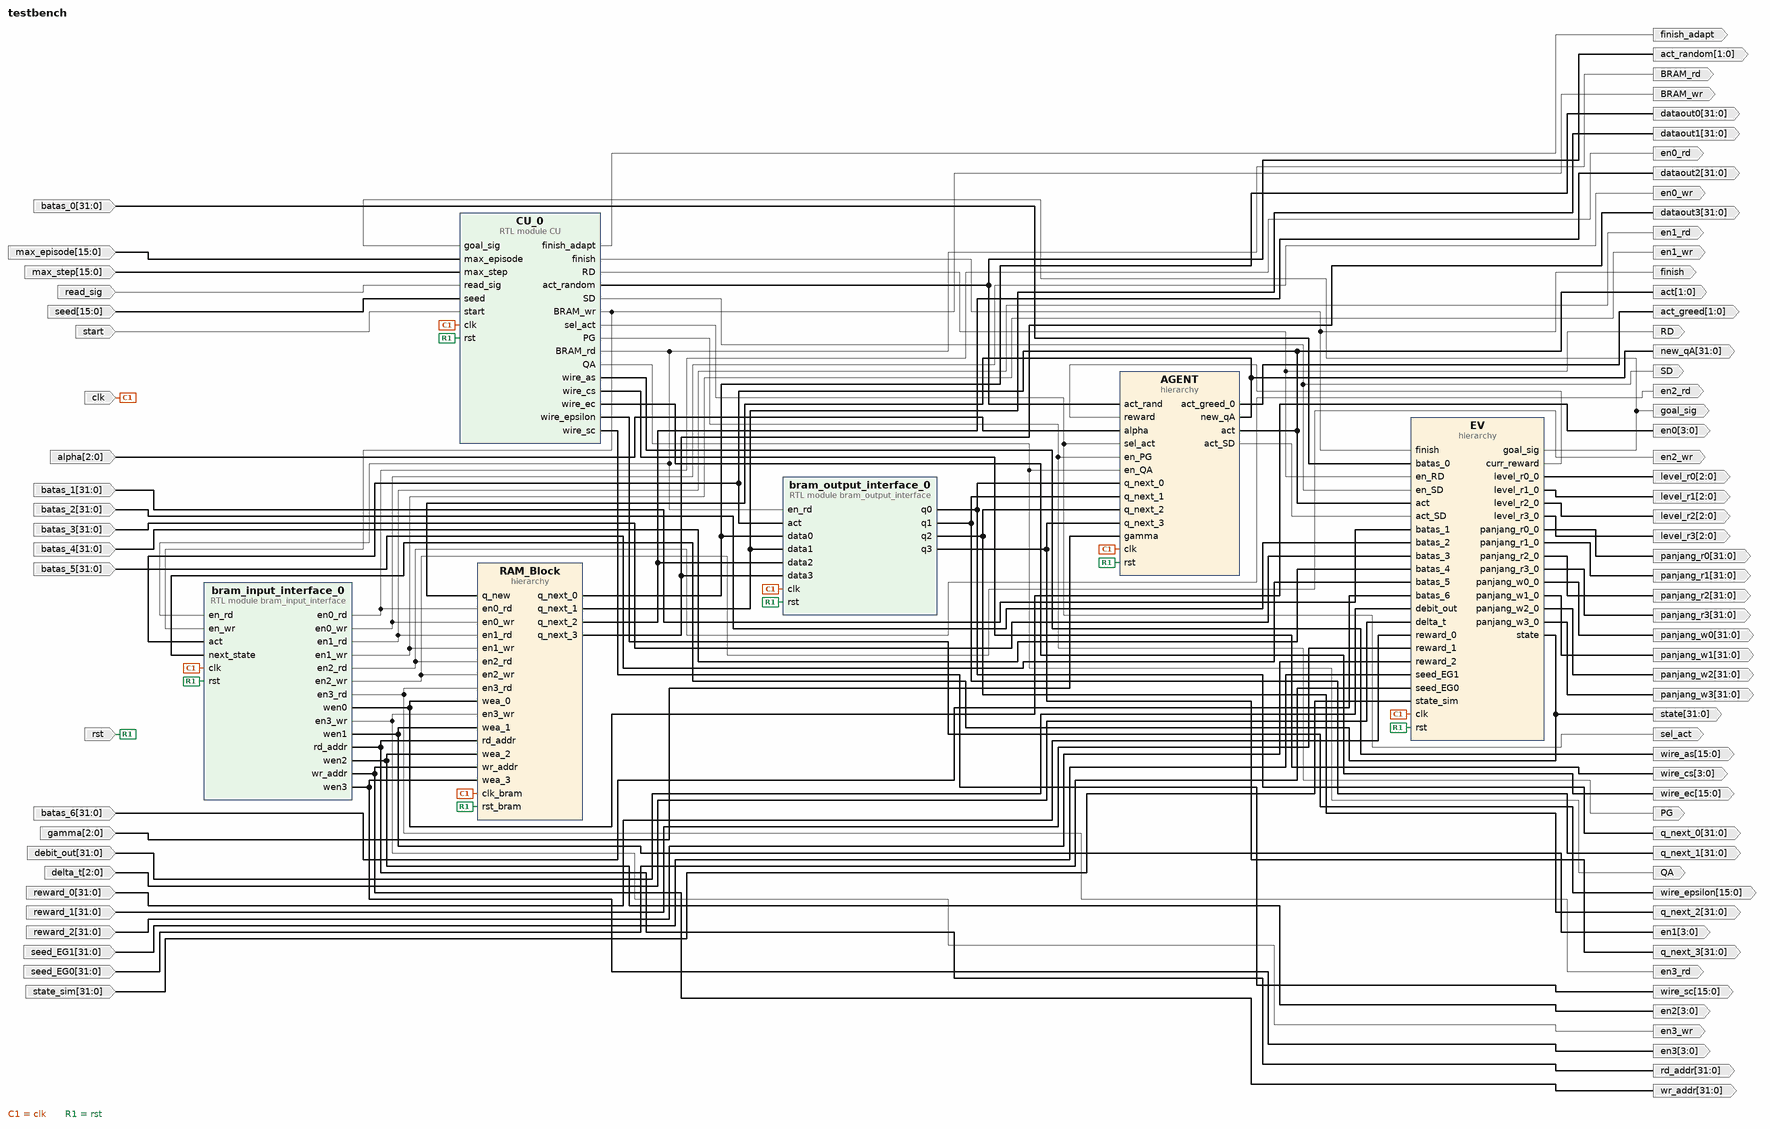
[diagram p0: block diagram of the top level]
# Vivado block design testbench, xc7z020clg400-1, Vivado 2021.1
create_bd_design testbench

create_bd_port -dir I -type clk clk
set_property -dict {CONFIG.FREQ_HZ 50000000} [get_bd_ports clk]
create_bd_port -dir I -type rst rst
create_bd_port -dir I -from 2 -to 0 alpha
create_bd_port -dir I -from 2 -to 0 gamma
create_bd_port -dir O finish
create_bd_port -dir I -from 15 -to 0 seed
create_bd_port -dir I -from 15 -to 0 max_episode
create_bd_port -dir I -from 15 -to 0 max_step
create_bd_port -dir I start
create_bd_port -dir I -from 31 -to 0 reward_0
create_bd_port -dir I -from 31 -to 0 reward_1
create_bd_port -dir I -from 31 -to 0 reward_2
create_bd_port -dir I -from 2 -to 0 delta_t
create_bd_port -dir I -from 31 -to 0 batas_0
create_bd_port -dir I -from 31 -to 0 batas_1
create_bd_port -dir I -from 31 -to 0 batas_2
create_bd_port -dir O PG
create_bd_port -dir O QA
create_bd_port -dir O SD
create_bd_port -dir O RD
create_bd_port -dir O -from 15 -to 0 wire_sc
create_bd_port -dir O -from 15 -to 0 wire_ec
create_bd_port -dir O -from 3 -to 0 wire_cs
create_bd_port -dir O goal_sig
create_bd_port -dir O -from 31 -to 0 state
create_bd_port -dir O sel_act
create_bd_port -dir O -from 2 -to 0 level_r0
create_bd_port -dir O -from 2 -to 0 level_r1
create_bd_port -dir O -from 2 -to 0 level_r2
create_bd_port -dir O -from 2 -to 0 level_r3
create_bd_port -dir O -from 31 -to 0 panjang_w0
create_bd_port -dir O -from 31 -to 0 panjang_w1
create_bd_port -dir O -from 31 -to 0 panjang_w2
create_bd_port -dir O -from 31 -to 0 panjang_w3
create_bd_port -dir O -from 31 -to 0 panjang_r0
create_bd_port -dir O -from 31 -to 0 panjang_r1
create_bd_port -dir O -from 31 -to 0 panjang_r2
create_bd_port -dir O -from 31 -to 0 panjang_r3
create_bd_port -dir O -from 1 -to 0 act
create_bd_port -dir O -from 1 -to 0 act_greed
create_bd_port -dir O -from 31 -to 0 q_next_3
create_bd_port -dir O -from 31 -to 0 q_next_0
create_bd_port -dir O -from 31 -to 0 q_next_1
create_bd_port -dir O -from 31 -to 0 q_next_2
create_bd_port -dir O -from 31 -to 0 new_qA
create_bd_port -dir O -from 31 -to 0 rd_addr
create_bd_port -dir O -from 31 -to 0 wr_addr
create_bd_port -dir O -from 3 -to 0 en0
create_bd_port -dir O -from 3 -to 0 en1
create_bd_port -dir O -from 3 -to 0 en2
create_bd_port -dir O -from 3 -to 0 en3
create_bd_port -dir O -from 1 -to 0 act_random
create_bd_port -dir O -from 31 -to 0 dataout3
create_bd_port -dir O -from 31 -to 0 dataout0
create_bd_port -dir O -from 31 -to 0 dataout1
create_bd_port -dir O -from 31 -to 0 dataout2
create_bd_port -dir O en0_wr
create_bd_port -dir O en0_rd
create_bd_port -dir O en1_wr
create_bd_port -dir O en1_rd
create_bd_port -dir O en2_wr
create_bd_port -dir O en2_rd
create_bd_port -dir O en3_wr
create_bd_port -dir O en3_rd
create_bd_port -dir I -from 31 -to 0 debit_out
create_bd_port -dir I -from 31 -to 0 state_sim
create_bd_port -dir O BRAM_rd
create_bd_port -dir O BRAM_wr
create_bd_port -dir O -from 15 -to 0 wire_as
create_bd_port -dir O -from 15 -to 0 wire_epsilon
create_bd_port -dir O finish_adapt
create_bd_port -dir I -from 31 -to 0 batas_3
create_bd_port -dir I -from 31 -to 0 batas_4
create_bd_port -dir I -from 31 -to 0 batas_5
create_bd_port -dir I -from 31 -to 0 batas_6
create_bd_port -dir I read_sig
create_bd_port -dir I -from 31 -to 0 seed_EG0
create_bd_port -dir I -from 31 -to 0 seed_EG1

create_bd_cell -type hier AGENT
create_bd_cell -type hier EV
create_bd_cell -type hier RAM_Block
create_bd_cell -type module -reference bram_output_interface bram_output_interface_0
create_bd_cell -type module -reference bram_input_interface bram_input_interface_0
create_bd_cell -type module -reference CU CU_0

# ---- hierarchy /AGENT ----
current_bd_instance /AGENT
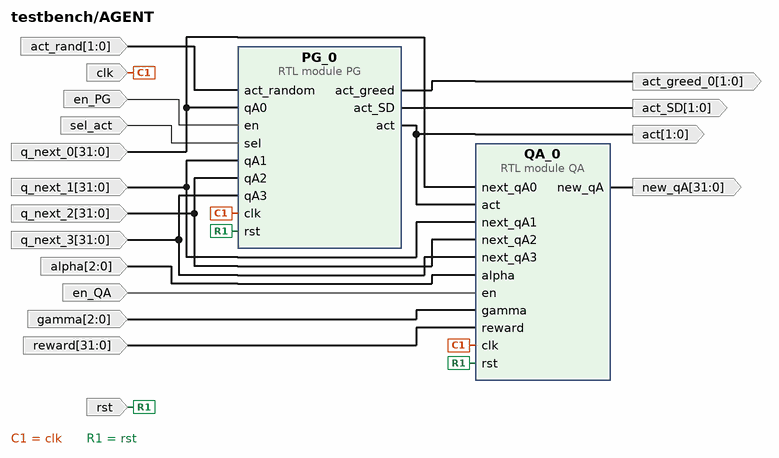
[diagram p1: block diagram inside /AGENT]
create_bd_pin -dir I sel_act
create_bd_pin -dir I -from 1 -to 0 act_rand
create_bd_pin -dir O -from 1 -to 0 act
create_bd_pin -dir I -type clk clk
create_bd_pin -dir I -type rst rst
create_bd_pin -dir I -from 31 -to 0 q_next_0
create_bd_pin -dir I -from 31 -to 0 q_next_1
create_bd_pin -dir I -from 31 -to 0 q_next_2
create_bd_pin -dir I -from 31 -to 0 q_next_3
create_bd_pin -dir O -from 31 -to 0 new_qA
create_bd_pin -dir I -from 2 -to 0 alpha
create_bd_pin -dir I -from 2 -to 0 gamma
create_bd_pin -dir I -from 31 -to 0 reward
create_bd_pin -dir I en_PG
create_bd_pin -dir I en_QA
create_bd_pin -dir O -from 1 -to 0 act_greed_0
create_bd_pin -dir O -from 1 -to 0 act_SD

create_bd_cell -type module -reference PG PG_0
create_bd_cell -type module -reference QA QA_0

# ---- hierarchy /EV ----
current_bd_instance /EV
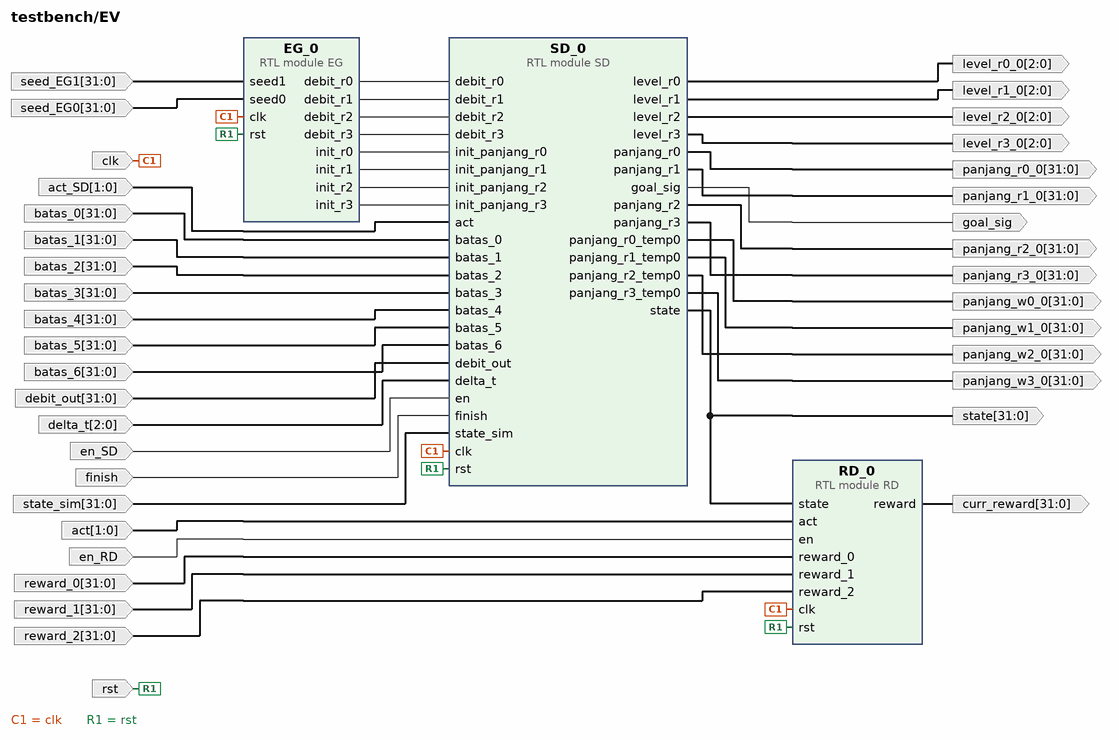
[diagram p2: block diagram inside /EV]
create_bd_pin -dir I -type clk clk
create_bd_pin -dir I -from 1 -to 0 act
create_bd_pin -dir I -from 2 -to 0 delta_t
create_bd_pin -dir I -from 31 -to 0 batas_0
create_bd_pin -dir I -from 31 -to 0 batas_1
create_bd_pin -dir I -from 31 -to 0 batas_2
create_bd_pin -dir O -from 31 -to 0 state
create_bd_pin -dir I -from 31 -to 0 reward_0
create_bd_pin -dir I -from 31 -to 0 reward_1
create_bd_pin -dir I -from 31 -to 0 reward_2
create_bd_pin -dir O -from 31 -to 0 curr_reward
create_bd_pin -dir O goal_sig
create_bd_pin -dir I -type rst rst
create_bd_pin -dir I en_SD
create_bd_pin -dir I en_RD
create_bd_pin -dir O -from 2 -to 0 level_r0_0
create_bd_pin -dir O -from 2 -to 0 level_r1_0
create_bd_pin -dir O -from 2 -to 0 level_r2_0
create_bd_pin -dir O -from 2 -to 0 level_r3_0
create_bd_pin -dir O -from 31 -to 0 panjang_w0_0
create_bd_pin -dir O -from 31 -to 0 panjang_w1_0
create_bd_pin -dir O -from 31 -to 0 panjang_w2_0
create_bd_pin -dir O -from 31 -to 0 panjang_w3_0
create_bd_pin -dir O -from 31 -to 0 panjang_r0_0
create_bd_pin -dir O -from 31 -to 0 panjang_r1_0
create_bd_pin -dir O -from 31 -to 0 panjang_r2_0
create_bd_pin -dir O -from 31 -to 0 panjang_r3_0
create_bd_pin -dir I -from 31 -to 0 debit_out
create_bd_pin -dir I finish
create_bd_pin -dir I -from 31 -to 0 state_sim
create_bd_pin -dir I -from 1 -to 0 act_SD
create_bd_pin -dir I -from 31 -to 0 batas_3
create_bd_pin -dir I -from 31 -to 0 batas_4
create_bd_pin -dir I -from 31 -to 0 batas_5
create_bd_pin -dir I -from 31 -to 0 batas_6
create_bd_pin -dir I -from 31 -to 0 seed_EG0
create_bd_pin -dir I -from 31 -to 0 seed_EG1

create_bd_cell -type module -reference RD RD_0
create_bd_cell -type module -reference SD SD_0
create_bd_cell -type module -reference EG EG_0

# ---- hierarchy /RAM_Block ----
current_bd_instance /RAM_Block
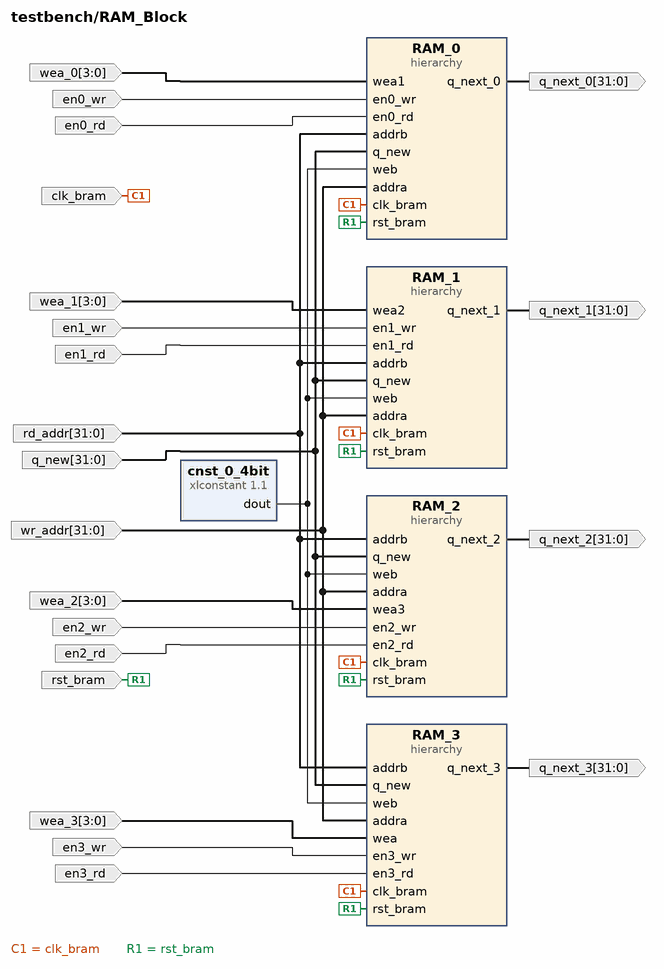
[diagram p3: block diagram inside /RAM_Block]
create_bd_pin -dir I -type clk clk_bram
create_bd_pin -dir I -type rst rst_bram
create_bd_pin -dir I -from 3 -to 0 wea_3
create_bd_pin -dir I -from 31 -to 0 wr_addr
create_bd_pin -dir I -from 31 -to 0 q_new
create_bd_pin -dir I -from 31 -to 0 rd_addr
create_bd_pin -dir O -from 31 -to 0 q_next_3
create_bd_pin -dir I -from 3 -to 0 wea_0
create_bd_pin -dir O -from 31 -to 0 q_next_0
create_bd_pin -dir I -from 3 -to 0 wea_1
create_bd_pin -dir O -from 31 -to 0 q_next_1
create_bd_pin -dir I -from 3 -to 0 wea_2
create_bd_pin -dir O -from 31 -to 0 q_next_2
create_bd_pin -dir I en0_wr
create_bd_pin -dir I en0_rd
create_bd_pin -dir I en1_wr
create_bd_pin -dir I en1_rd
create_bd_pin -dir I en2_wr
create_bd_pin -dir I en2_rd
create_bd_pin -dir I en3_wr
create_bd_pin -dir I en3_rd

create_bd_cell -type ip -vlnv xilinx.com:ip:xlconstant:1.1 cnst_0_4bit
set_property -dict {CONFIG.CONST_VAL 0 CONFIG.CONST_WIDTH 4} [get_bd_cells cnst_0_4bit]
create_bd_cell -type hier RAM_2
create_bd_cell -type hier RAM_1
create_bd_cell -type hier RAM_3
create_bd_cell -type hier RAM_0

# ---- hierarchy /RAM_Block/RAM_2 ----
current_bd_instance /RAM_Block/RAM_2
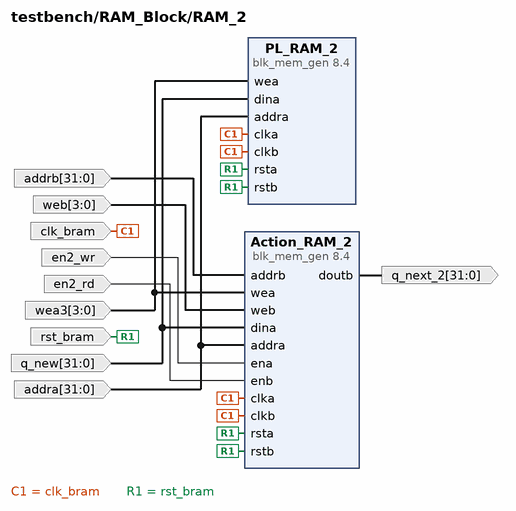
[diagram p4: block diagram inside /RAM_Block/RAM_2]
create_bd_pin -dir I -type clk clk_bram
create_bd_pin -dir I -type rst rst_bram
create_bd_pin -dir I -from 3 -to 0 wea3
create_bd_pin -dir I -from 31 -to 0 addra
create_bd_pin -dir I -from 31 -to 0 q_new
create_bd_pin -dir I -from 3 -to 0 web
create_bd_pin -dir I -from 31 -to 0 addrb
create_bd_pin -dir O -from 31 -to 0 q_next_2
create_bd_pin -dir I en2_wr
create_bd_pin -dir I en2_rd

create_bd_cell -type ip -vlnv xilinx.com:ip:blk_mem_gen:8.4 Action_RAM_2
set_property -dict [list \
  CONFIG.EN_SAFETY_CKT true \
  CONFIG.Enable_32bit_Address true \
  CONFIG.Enable_B Use_ENB_Pin \
  CONFIG.Memory_Type True_Dual_Port_RAM \
  CONFIG.Operating_Mode_A WRITE_FIRST \
  CONFIG.Operating_Mode_B WRITE_FIRST \
  CONFIG.Port_B_Clock 100 \
  CONFIG.Port_B_Enable_Rate 100 \
  CONFIG.Port_B_Write_Rate 50 \
  CONFIG.Read_Width_A 32 \
  CONFIG.Read_Width_B 32 \
  CONFIG.Register_PortA_Output_of_Memory_Primitives false \
  CONFIG.Register_PortB_Output_of_Memory_Primitives false \
  CONFIG.Use_RSTA_Pin true \
  CONFIG.Use_RSTB_Pin true \
  CONFIG.Write_Width_A 32 \
  CONFIG.Write_Width_B 32 \
  CONFIG.use_bram_block BRAM_Controller \
] [get_bd_cells Action_RAM_2]
create_bd_cell -type ip -vlnv xilinx.com:ip:blk_mem_gen:8.4 PL_RAM_2
set_property -dict [list \
  CONFIG.Enable_B Use_ENB_Pin \
  CONFIG.Memory_Type True_Dual_Port_RAM \
  CONFIG.Port_B_Clock 100 \
  CONFIG.Port_B_Enable_Rate 100 \
  CONFIG.Port_B_Write_Rate 50 \
  CONFIG.Use_RSTB_Pin true \
] [get_bd_cells PL_RAM_2]

# ---- hierarchy /RAM_Block/RAM_1 ----
current_bd_instance /RAM_Block/RAM_1
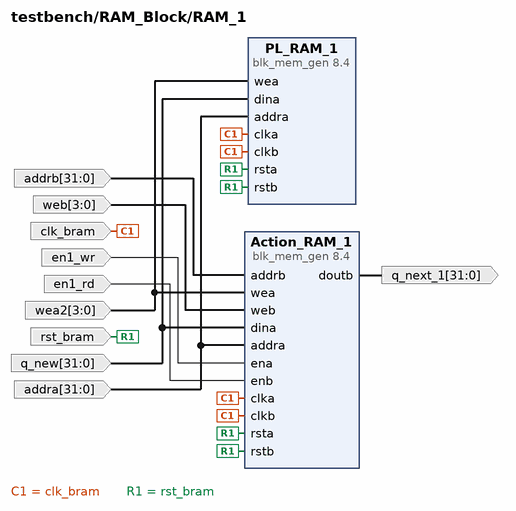
[diagram p5: block diagram inside /RAM_Block/RAM_1]
create_bd_pin -dir I -type clk clk_bram
create_bd_pin -dir I -type rst rst_bram
create_bd_pin -dir I -from 3 -to 0 wea2
create_bd_pin -dir I -from 31 -to 0 addra
create_bd_pin -dir I -from 31 -to 0 q_new
create_bd_pin -dir I -from 3 -to 0 web
create_bd_pin -dir I -from 31 -to 0 addrb
create_bd_pin -dir O -from 31 -to 0 q_next_1
create_bd_pin -dir I en1_wr
create_bd_pin -dir I en1_rd

create_bd_cell -type ip -vlnv xilinx.com:ip:blk_mem_gen:8.4 Action_RAM_1
set_property -dict [list \
  CONFIG.EN_SAFETY_CKT true \
  CONFIG.Enable_32bit_Address true \
  CONFIG.Enable_B Use_ENB_Pin \
  CONFIG.Memory_Type True_Dual_Port_RAM \
  CONFIG.Operating_Mode_A WRITE_FIRST \
  CONFIG.Operating_Mode_B WRITE_FIRST \
  CONFIG.Port_B_Clock 100 \
  CONFIG.Port_B_Enable_Rate 100 \
  CONFIG.Port_B_Write_Rate 50 \
  CONFIG.Read_Width_A 32 \
  CONFIG.Read_Width_B 32 \
  CONFIG.Register_PortA_Output_of_Memory_Primitives false \
  CONFIG.Register_PortB_Output_of_Memory_Primitives false \
  CONFIG.Use_RSTA_Pin true \
  CONFIG.Use_RSTB_Pin true \
  CONFIG.Write_Width_A 32 \
  CONFIG.Write_Width_B 32 \
  CONFIG.use_bram_block BRAM_Controller \
] [get_bd_cells Action_RAM_1]
create_bd_cell -type ip -vlnv xilinx.com:ip:blk_mem_gen:8.4 PL_RAM_1
set_property -dict [list \
  CONFIG.Enable_B Use_ENB_Pin \
  CONFIG.Memory_Type True_Dual_Port_RAM \
  CONFIG.Port_B_Clock 100 \
  CONFIG.Port_B_Enable_Rate 100 \
  CONFIG.Port_B_Write_Rate 50 \
  CONFIG.Use_RSTB_Pin true \
] [get_bd_cells PL_RAM_1]

# ---- hierarchy /RAM_Block/RAM_3 ----
current_bd_instance /RAM_Block/RAM_3
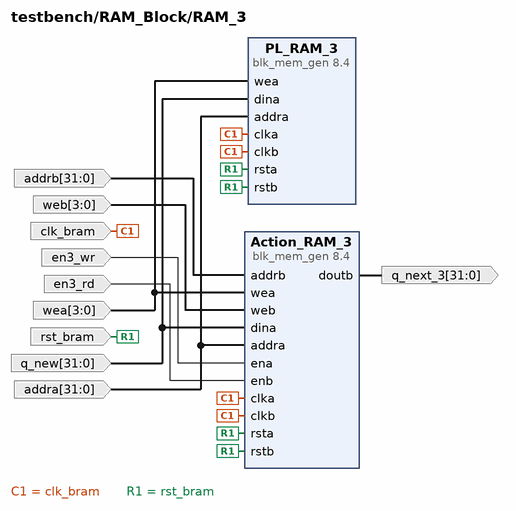
[diagram p6: block diagram inside /RAM_Block/RAM_3]
create_bd_pin -dir I -type clk clk_bram
create_bd_pin -dir I -type rst rst_bram
create_bd_pin -dir I -from 3 -to 0 wea
create_bd_pin -dir I -from 31 -to 0 addra
create_bd_pin -dir I -from 31 -to 0 q_new
create_bd_pin -dir I -from 3 -to 0 web
create_bd_pin -dir I -from 31 -to 0 addrb
create_bd_pin -dir O -from 31 -to 0 q_next_3
create_bd_pin -dir I en3_wr
create_bd_pin -dir I en3_rd

create_bd_cell -type ip -vlnv xilinx.com:ip:blk_mem_gen:8.4 Action_RAM_3
set_property -dict [list \
  CONFIG.EN_SAFETY_CKT true \
  CONFIG.Enable_32bit_Address true \
  CONFIG.Enable_B Use_ENB_Pin \
  CONFIG.Memory_Type True_Dual_Port_RAM \
  CONFIG.Operating_Mode_A WRITE_FIRST \
  CONFIG.Operating_Mode_B WRITE_FIRST \
  CONFIG.Port_B_Clock 100 \
  CONFIG.Port_B_Enable_Rate 100 \
  CONFIG.Port_B_Write_Rate 50 \
  CONFIG.Read_Width_A 32 \
  CONFIG.Read_Width_B 32 \
  CONFIG.Register_PortA_Output_of_Memory_Primitives false \
  CONFIG.Register_PortB_Output_of_Memory_Primitives false \
  CONFIG.Use_RSTA_Pin true \
  CONFIG.Use_RSTB_Pin true \
  CONFIG.Write_Width_A 32 \
  CONFIG.Write_Width_B 32 \
  CONFIG.use_bram_block BRAM_Controller \
] [get_bd_cells Action_RAM_3]
create_bd_cell -type ip -vlnv xilinx.com:ip:blk_mem_gen:8.4 PL_RAM_3
set_property -dict [list \
  CONFIG.Enable_B Use_ENB_Pin \
  CONFIG.Memory_Type True_Dual_Port_RAM \
  CONFIG.Port_B_Clock 100 \
  CONFIG.Port_B_Enable_Rate 100 \
  CONFIG.Port_B_Write_Rate 50 \
  CONFIG.Use_RSTB_Pin true \
] [get_bd_cells PL_RAM_3]

# ---- hierarchy /RAM_Block/RAM_0 ----
current_bd_instance /RAM_Block/RAM_0
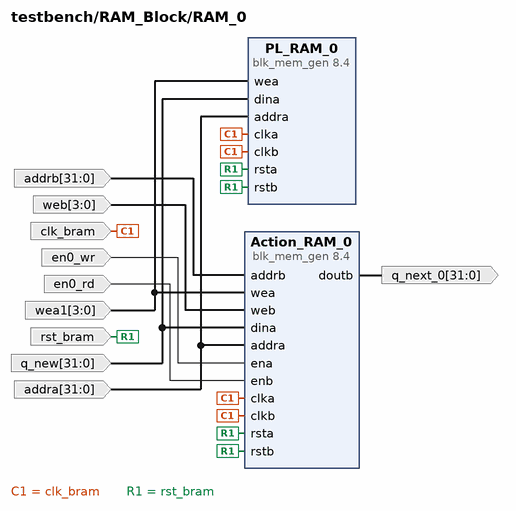
[diagram p7: block diagram inside /RAM_Block/RAM_0]
create_bd_pin -dir I -type clk clk_bram
create_bd_pin -dir I -type rst rst_bram
create_bd_pin -dir I -from 3 -to 0 wea1
create_bd_pin -dir I -from 31 -to 0 addra
create_bd_pin -dir I -from 31 -to 0 q_new
create_bd_pin -dir I -from 3 -to 0 web
create_bd_pin -dir I -from 31 -to 0 addrb
create_bd_pin -dir O -from 31 -to 0 q_next_0
create_bd_pin -dir I en0_wr
create_bd_pin -dir I en0_rd

create_bd_cell -type ip -vlnv xilinx.com:ip:blk_mem_gen:8.4 PL_RAM_0
set_property -dict [list \
  CONFIG.Enable_B Use_ENB_Pin \
  CONFIG.Memory_Type True_Dual_Port_RAM \
  CONFIG.Port_B_Clock 100 \
  CONFIG.Port_B_Enable_Rate 100 \
  CONFIG.Port_B_Write_Rate 50 \
  CONFIG.Use_RSTB_Pin true \
] [get_bd_cells PL_RAM_0]
create_bd_cell -type ip -vlnv xilinx.com:ip:blk_mem_gen:8.4 Action_RAM_0
set_property -dict [list \
  CONFIG.EN_SAFETY_CKT true \
  CONFIG.Enable_32bit_Address true \
  CONFIG.Enable_B Use_ENB_Pin \
  CONFIG.Memory_Type True_Dual_Port_RAM \
  CONFIG.Operating_Mode_A WRITE_FIRST \
  CONFIG.Operating_Mode_B WRITE_FIRST \
  CONFIG.Port_B_Clock 100 \
  CONFIG.Port_B_Enable_Rate 100 \
  CONFIG.Port_B_Write_Rate 50 \
  CONFIG.Read_Width_A 32 \
  CONFIG.Read_Width_B 32 \
  CONFIG.Register_PortA_Output_of_Memory_Primitives false \
  CONFIG.Register_PortB_Output_of_Memory_Primitives false \
  CONFIG.Use_RSTA_Pin true \
  CONFIG.Use_RSTB_Pin true \
  CONFIG.Write_Width_A 32 \
  CONFIG.Write_Width_B 32 \
  CONFIG.use_bram_block BRAM_Controller \
] [get_bd_cells Action_RAM_0]

# ---- connections ----

current_bd_instance /AGENT
connect_bd_net -net Action_RAM_q_next_0 [get_bd_pins q_next_0] [get_bd_pins PG_0/qA0] [get_bd_pins QA_0/next_qA0]
connect_bd_net -net Action_RAM_q_next_1 [get_bd_pins q_next_1] [get_bd_pins PG_0/qA1] [get_bd_pins QA_0/next_qA1]
connect_bd_net -net Action_RAM_q_next_2 [get_bd_pins q_next_2] [get_bd_pins PG_0/qA2] [get_bd_pins QA_0/next_qA2]
connect_bd_net -net Action_RAM_q_next_3 [get_bd_pins q_next_3] [get_bd_pins PG_0/qA3] [get_bd_pins QA_0/next_qA3]
connect_bd_net [get_bd_pins PG_0/act] [get_bd_pins act] [get_bd_pins QA_0/act]
connect_bd_net [get_bd_pins PG_0/act_SD] [get_bd_pins act_SD]
connect_bd_net [get_bd_pins PG_0/act_greed] [get_bd_pins act_greed_0]
connect_bd_net [get_bd_pins QA_0/new_qA] [get_bd_pins new_qA]
connect_bd_net -net act_random_0_1 [get_bd_pins act_rand] [get_bd_pins PG_0/act_random]
connect_bd_net [get_bd_pins alpha] [get_bd_pins QA_0/alpha]
connect_bd_net [get_bd_pins clk] [get_bd_pins PG_0/clk] [get_bd_pins QA_0/clk]
connect_bd_net -net en_1 [get_bd_pins en_PG] [get_bd_pins PG_0/en]
connect_bd_net -net en_2 [get_bd_pins en_QA] [get_bd_pins QA_0/en]
connect_bd_net [get_bd_pins gamma] [get_bd_pins QA_0/gamma]
connect_bd_net -net reg_32bit_0_out0 [get_bd_pins reward] [get_bd_pins QA_0/reward]
connect_bd_net -net rst_bram_1 [get_bd_pins rst] [get_bd_pins PG_0/rst] [get_bd_pins QA_0/rst]
connect_bd_net -net sel_0_1 [get_bd_pins sel_act] [get_bd_pins PG_0/sel]

current_bd_instance /EV
connect_bd_net [get_bd_pins EG_0/debit_r0] [get_bd_pins SD_0/debit_r0]
connect_bd_net [get_bd_pins EG_0/debit_r1] [get_bd_pins SD_0/debit_r1]
connect_bd_net [get_bd_pins EG_0/debit_r2] [get_bd_pins SD_0/debit_r2]
connect_bd_net [get_bd_pins EG_0/debit_r3] [get_bd_pins SD_0/debit_r3]
connect_bd_net [get_bd_pins EG_0/init_r0] [get_bd_pins SD_0/init_panjang_r0]
connect_bd_net [get_bd_pins EG_0/init_r1] [get_bd_pins SD_0/init_panjang_r1]
connect_bd_net [get_bd_pins EG_0/init_r2] [get_bd_pins SD_0/init_panjang_r2]
connect_bd_net [get_bd_pins EG_0/init_r3] [get_bd_pins SD_0/init_panjang_r3]
connect_bd_net -net PG_0_act [get_bd_pins act] [get_bd_pins RD_0/act]
connect_bd_net [get_bd_pins RD_0/reward] [get_bd_pins curr_reward]
connect_bd_net [get_bd_pins SD_0/level_r0] [get_bd_pins level_r0_0]
connect_bd_net [get_bd_pins SD_0/level_r1] [get_bd_pins level_r1_0]
connect_bd_net [get_bd_pins SD_0/level_r2] [get_bd_pins level_r2_0]
connect_bd_net [get_bd_pins SD_0/level_r3] [get_bd_pins level_r3_0]
connect_bd_net [get_bd_pins SD_0/panjang_r0] [get_bd_pins panjang_r0_0]
connect_bd_net [get_bd_pins SD_0/panjang_r1] [get_bd_pins panjang_r1_0]
connect_bd_net [get_bd_pins SD_0/panjang_r2] [get_bd_pins panjang_r2_0]
connect_bd_net [get_bd_pins SD_0/panjang_r3] [get_bd_pins panjang_r3_0]
connect_bd_net -net SD_0_panjang_w0 [get_bd_pins SD_0/panjang_r0_temp0] [get_bd_pins panjang_w0_0]
connect_bd_net -net SD_0_panjang_w1 [get_bd_pins SD_0/panjang_r1_temp0] [get_bd_pins panjang_w1_0]
connect_bd_net -net SD_0_panjang_w2 [get_bd_pins SD_0/panjang_r2_temp0] [get_bd_pins panjang_w2_0]
connect_bd_net -net SD_0_panjang_w3 [get_bd_pins SD_0/panjang_r3_temp0] [get_bd_pins panjang_w3_0]
connect_bd_net -net SD_0_sig_goal [get_bd_pins SD_0/goal_sig] [get_bd_pins goal_sig]
connect_bd_net -net act_0_1 [get_bd_pins act_SD] [get_bd_pins SD_0/act]
connect_bd_net -net batas_0_0_1 [get_bd_pins batas_0] [get_bd_pins SD_0/batas_0]
connect_bd_net -net batas_1_0_1 [get_bd_pins batas_1] [get_bd_pins SD_0/batas_1]
connect_bd_net -net batas_2_0_1 [get_bd_pins batas_2] [get_bd_pins SD_0/batas_2]
connect_bd_net -net batas_3_0_1 [get_bd_pins batas_3] [get_bd_pins SD_0/batas_3]
connect_bd_net -net batas_4_0_1 [get_bd_pins batas_4] [get_bd_pins SD_0/batas_4]
connect_bd_net -net batas_5_0_1 [get_bd_pins batas_5] [get_bd_pins SD_0/batas_5]
connect_bd_net -net batas_6_0_1 [get_bd_pins batas_6] [get_bd_pins SD_0/batas_6]
connect_bd_net [get_bd_pins clk] [get_bd_pins RD_0/clk] [get_bd_pins SD_0/clk] [get_bd_pins EG_0/clk]
connect_bd_net -net debit_out_0_1 [get_bd_pins debit_out] [get_bd_pins SD_0/debit_out]
connect_bd_net -net delta_t_0_1 [get_bd_pins delta_t] [get_bd_pins SD_0/delta_t]
connect_bd_net -net en_1 [get_bd_pins en_SD] [get_bd_pins SD_0/en]
connect_bd_net -net en_2 [get_bd_pins en_RD] [get_bd_pins RD_0/en]
connect_bd_net -net finish_0_1 [get_bd_pins finish] [get_bd_pins SD_0/finish]
connect_bd_net -net next_state_1 [get_bd_pins SD_0/state] [get_bd_pins state] [get_bd_pins RD_0/state]
connect_bd_net -net reward_0_0_1 [get_bd_pins reward_0] [get_bd_pins RD_0/reward_0]
connect_bd_net -net reward_1_0_1 [get_bd_pins reward_1] [get_bd_pins RD_0/reward_1]
connect_bd_net -net reward_2_0_1 [get_bd_pins reward_2] [get_bd_pins RD_0/reward_2]
connect_bd_net [get_bd_pins rst] [get_bd_pins RD_0/rst] [get_bd_pins SD_0/rst] [get_bd_pins EG_0/rst]
connect_bd_net -net seed1_0_1 [get_bd_pins seed_EG1] [get_bd_pins EG_0/seed1]
connect_bd_net -net seed_0_1 [get_bd_pins seed_EG0] [get_bd_pins EG_0/seed0]
connect_bd_net -net state_sim_0_1 [get_bd_pins state_sim] [get_bd_pins SD_0/state_sim]

current_bd_instance /RAM_Block
connect_bd_net -net Action_RAM_0_doutb [get_bd_pins RAM_0/q_next_0] [get_bd_pins q_next_0]
connect_bd_net -net Action_RAM_1_doutb [get_bd_pins RAM_1/q_next_1] [get_bd_pins q_next_1]
connect_bd_net -net Action_RAM_2_doutb [get_bd_pins RAM_2/q_next_2] [get_bd_pins q_next_2]
connect_bd_net -net Action_RAM_3_doutb [get_bd_pins RAM_3/q_next_3] [get_bd_pins q_next_3]
connect_bd_net -net bram_interface_0_en0 [get_bd_pins wea_0] [get_bd_pins RAM_0/wea1]
connect_bd_net -net bram_interface_0_en1 [get_bd_pins wea_1] [get_bd_pins RAM_1/wea2]
connect_bd_net -net bram_interface_0_en2 [get_bd_pins wea_2] [get_bd_pins RAM_2/wea3]
connect_bd_net -net bram_interface_0_en3 [get_bd_pins wea_3] [get_bd_pins RAM_3/wea]
connect_bd_net -net bram_interface_0_rd_addr [get_bd_pins rd_addr] \
  [get_bd_pins RAM_2/addrb] [get_bd_pins RAM_1/addrb] [get_bd_pins RAM_3/addrb] [get_bd_pins RAM_0/addrb]
connect_bd_net -net clk_0_1 [get_bd_pins clk_bram] \
  [get_bd_pins RAM_2/clk_bram] [get_bd_pins RAM_1/clk_bram] [get_bd_pins RAM_3/clk_bram] [get_bd_pins RAM_0/clk_bram]
connect_bd_net [get_bd_pins cnst_0_4bit/dout] [get_bd_pins RAM_2/web] [get_bd_pins RAM_1/web] [get_bd_pins RAM_3/web] [get_bd_pins RAM_0/web]
connect_bd_net -net dina_0_1 [get_bd_pins q_new] \
  [get_bd_pins RAM_2/q_new] [get_bd_pins RAM_1/q_new] [get_bd_pins RAM_3/q_new] [get_bd_pins RAM_0/q_new]
connect_bd_net -net ena_0_1 [get_bd_pins en0_wr] [get_bd_pins RAM_0/en0_wr]
connect_bd_net -net ena_1_1 [get_bd_pins en1_wr] [get_bd_pins RAM_1/en1_wr]
connect_bd_net -net ena_2_1 [get_bd_pins en2_wr] [get_bd_pins RAM_2/en2_wr]
connect_bd_net -net ena_3_1 [get_bd_pins en3_wr] [get_bd_pins RAM_3/en3_wr]
connect_bd_net -net enb_0_1 [get_bd_pins en0_rd] [get_bd_pins RAM_0/en0_rd]
connect_bd_net -net enb_1_1 [get_bd_pins en1_rd] [get_bd_pins RAM_1/en1_rd]
connect_bd_net -net enb_2_1 [get_bd_pins en2_rd] [get_bd_pins RAM_2/en2_rd]
connect_bd_net -net enb_3_1 [get_bd_pins en3_rd] [get_bd_pins RAM_3/en3_rd]
connect_bd_net -net reg_32bit_0_out0 [get_bd_pins wr_addr] \
  [get_bd_pins RAM_2/addra] [get_bd_pins RAM_1/addra] [get_bd_pins RAM_3/addra] [get_bd_pins RAM_0/addra]
connect_bd_net -net rsta_0_1 [get_bd_pins rst_bram] \
  [get_bd_pins RAM_2/rst_bram] [get_bd_pins RAM_1/rst_bram] [get_bd_pins RAM_3/rst_bram] [get_bd_pins RAM_0/rst_bram]

current_bd_instance /RAM_Block/RAM_2
connect_bd_net [get_bd_pins Action_RAM_2/doutb] [get_bd_pins q_next_2]
connect_bd_net -net bram_interface_0_en2 [get_bd_pins wea3] [get_bd_pins PL_RAM_2/wea] [get_bd_pins Action_RAM_2/wea]
connect_bd_net -net bram_interface_0_rd_addr [get_bd_pins addrb] [get_bd_pins Action_RAM_2/addrb]
connect_bd_net -net clk_0_1 [get_bd_pins clk_bram] \
  [get_bd_pins Action_RAM_2/clkb] [get_bd_pins PL_RAM_2/clka] [get_bd_pins Action_RAM_2/clka] [get_bd_pins PL_RAM_2/clkb]
connect_bd_net -net cnst_0_4bit_dout [get_bd_pins web] [get_bd_pins Action_RAM_2/web]
connect_bd_net -net dina_0_1 [get_bd_pins q_new] [get_bd_pins PL_RAM_2/dina] [get_bd_pins Action_RAM_2/dina]
connect_bd_net -net ena_2_1 [get_bd_pins en2_wr] [get_bd_pins Action_RAM_2/ena]
connect_bd_net -net enb_2_1 [get_bd_pins en2_rd] [get_bd_pins Action_RAM_2/enb]
connect_bd_net -net reg_32bit_0_out0 [get_bd_pins addra] [get_bd_pins PL_RAM_2/addra] [get_bd_pins Action_RAM_2/addra]
connect_bd_net -net rsta_0_1 [get_bd_pins rst_bram] \
  [get_bd_pins Action_RAM_2/rstb] [get_bd_pins PL_RAM_2/rsta] [get_bd_pins Action_RAM_2/rsta] [get_bd_pins PL_RAM_2/rstb]

current_bd_instance /RAM_Block/RAM_1
connect_bd_net [get_bd_pins Action_RAM_1/doutb] [get_bd_pins q_next_1]
connect_bd_net -net bram_interface_0_en1 [get_bd_pins wea2] [get_bd_pins PL_RAM_1/wea] [get_bd_pins Action_RAM_1/wea]
connect_bd_net -net bram_interface_0_rd_addr [get_bd_pins addrb] [get_bd_pins Action_RAM_1/addrb]
connect_bd_net -net clk_0_1 [get_bd_pins clk_bram] \
  [get_bd_pins Action_RAM_1/clkb] [get_bd_pins PL_RAM_1/clka] [get_bd_pins Action_RAM_1/clka] [get_bd_pins PL_RAM_1/clkb]
connect_bd_net -net cnst_0_4bit_dout [get_bd_pins web] [get_bd_pins Action_RAM_1/web]
connect_bd_net -net dina_0_1 [get_bd_pins q_new] [get_bd_pins PL_RAM_1/dina] [get_bd_pins Action_RAM_1/dina]
connect_bd_net -net ena_1_1 [get_bd_pins en1_wr] [get_bd_pins Action_RAM_1/ena]
connect_bd_net -net enb_1_1 [get_bd_pins en1_rd] [get_bd_pins Action_RAM_1/enb]
connect_bd_net -net reg_32bit_0_out0 [get_bd_pins addra] [get_bd_pins PL_RAM_1/addra] [get_bd_pins Action_RAM_1/addra]
connect_bd_net -net rsta_0_1 [get_bd_pins rst_bram] \
  [get_bd_pins Action_RAM_1/rstb] [get_bd_pins PL_RAM_1/rsta] [get_bd_pins Action_RAM_1/rsta] [get_bd_pins PL_RAM_1/rstb]

current_bd_instance /RAM_Block/RAM_3
connect_bd_net [get_bd_pins Action_RAM_3/doutb] [get_bd_pins q_next_3]
connect_bd_net -net bram_interface_0_en3 [get_bd_pins wea] [get_bd_pins PL_RAM_3/wea] [get_bd_pins Action_RAM_3/wea]
connect_bd_net -net bram_interface_0_rd_addr [get_bd_pins addrb] [get_bd_pins Action_RAM_3/addrb]
connect_bd_net -net clk_0_1 [get_bd_pins clk_bram] \
  [get_bd_pins Action_RAM_3/clkb] [get_bd_pins PL_RAM_3/clka] [get_bd_pins Action_RAM_3/clka] [get_bd_pins PL_RAM_3/clkb]
connect_bd_net -net cnst_0_4bit_dout [get_bd_pins web] [get_bd_pins Action_RAM_3/web]
connect_bd_net -net dina_0_1 [get_bd_pins q_new] [get_bd_pins PL_RAM_3/dina] [get_bd_pins Action_RAM_3/dina]
connect_bd_net -net ena_3_1 [get_bd_pins en3_wr] [get_bd_pins Action_RAM_3/ena]
connect_bd_net -net enb_3_1 [get_bd_pins en3_rd] [get_bd_pins Action_RAM_3/enb]
connect_bd_net -net reg_32bit_0_out0 [get_bd_pins addra] [get_bd_pins PL_RAM_3/addra] [get_bd_pins Action_RAM_3/addra]
connect_bd_net -net rsta_0_1 [get_bd_pins rst_bram] \
  [get_bd_pins Action_RAM_3/rstb] [get_bd_pins PL_RAM_3/rsta] [get_bd_pins Action_RAM_3/rsta] [get_bd_pins PL_RAM_3/rstb]

current_bd_instance /RAM_Block/RAM_0
connect_bd_net [get_bd_pins Action_RAM_0/doutb] [get_bd_pins q_next_0]
connect_bd_net -net bram_interface_0_en0 [get_bd_pins wea1] [get_bd_pins Action_RAM_0/wea] [get_bd_pins PL_RAM_0/wea]
connect_bd_net -net bram_interface_0_rd_addr [get_bd_pins addrb] [get_bd_pins Action_RAM_0/addrb]
connect_bd_net -net clk_0_1 [get_bd_pins clk_bram] \
  [get_bd_pins Action_RAM_0/clkb] [get_bd_pins Action_RAM_0/clka] [get_bd_pins PL_RAM_0/clka] [get_bd_pins PL_RAM_0/clkb]
connect_bd_net -net cnst_0_4bit_dout [get_bd_pins web] [get_bd_pins Action_RAM_0/web]
connect_bd_net -net dina_0_1 [get_bd_pins q_new] [get_bd_pins Action_RAM_0/dina] [get_bd_pins PL_RAM_0/dina]
connect_bd_net -net ena_0_1 [get_bd_pins en0_wr] [get_bd_pins Action_RAM_0/ena]
connect_bd_net -net enb_0_1 [get_bd_pins en0_rd] [get_bd_pins Action_RAM_0/enb]
connect_bd_net -net reg_32bit_0_out0 [get_bd_pins addra] [get_bd_pins Action_RAM_0/addra] [get_bd_pins PL_RAM_0/addra]
connect_bd_net -net rsta_0_1 [get_bd_pins rst_bram] \
  [get_bd_pins Action_RAM_0/rstb] [get_bd_pins Action_RAM_0/rsta] [get_bd_pins PL_RAM_0/rsta] [get_bd_pins PL_RAM_0/rstb]

current_bd_instance /
connect_bd_net [get_bd_pins AGENT/act] \
  [get_bd_pins EV/act] [get_bd_ports act] [get_bd_pins bram_output_interface_0/act] [get_bd_pins bram_input_interface_0/act]
connect_bd_net [get_bd_pins AGENT/act_SD] [get_bd_pins EV/act_SD]
connect_bd_net [get_bd_pins AGENT/act_greed_0] [get_bd_ports act_greed]
connect_bd_net [get_bd_pins CU_0/BRAM_rd] \
  [get_bd_ports BRAM_rd] [get_bd_pins bram_output_interface_0/en_rd] [get_bd_pins bram_input_interface_0/en_rd]
connect_bd_net [get_bd_pins CU_0/BRAM_wr] [get_bd_ports BRAM_wr] [get_bd_pins bram_input_interface_0/en_wr]
connect_bd_net [get_bd_pins CU_0/RD] [get_bd_pins EV/en_RD] [get_bd_ports RD]
connect_bd_net [get_bd_pins CU_0/SD] [get_bd_pins EV/en_SD] [get_bd_ports SD]
connect_bd_net [get_bd_pins CU_0/act_random] [get_bd_pins AGENT/act_rand] [get_bd_ports act_random]
connect_bd_net [get_bd_pins CU_0/finish] [get_bd_ports finish] [get_bd_pins EV/finish]
connect_bd_net [get_bd_pins CU_0/finish_adapt] [get_bd_ports finish_adapt]
connect_bd_net [get_bd_pins CU_0/sel_act] [get_bd_pins AGENT/sel_act] [get_bd_ports sel_act]
connect_bd_net [get_bd_pins CU_0/wire_as] [get_bd_ports wire_as]
connect_bd_net [get_bd_pins CU_0/wire_cs] [get_bd_ports wire_cs]
connect_bd_net [get_bd_pins CU_0/wire_ec] [get_bd_ports wire_ec]
connect_bd_net [get_bd_pins CU_0/wire_epsilon] [get_bd_ports wire_epsilon]
connect_bd_net [get_bd_pins CU_0/wire_sc] [get_bd_ports wire_sc]
connect_bd_net [get_bd_pins EV/curr_reward] [get_bd_pins AGENT/reward]
connect_bd_net [get_bd_pins EV/goal_sig] [get_bd_ports goal_sig] [get_bd_pins CU_0/goal_sig]
connect_bd_net [get_bd_pins EV/level_r0_0] [get_bd_ports level_r0]
connect_bd_net [get_bd_pins EV/level_r1_0] [get_bd_ports level_r1]
connect_bd_net [get_bd_pins EV/level_r2_0] [get_bd_ports level_r2]
connect_bd_net [get_bd_pins EV/level_r3_0] [get_bd_ports level_r3]
connect_bd_net [get_bd_pins EV/panjang_r0_0] [get_bd_ports panjang_r0]
connect_bd_net [get_bd_pins EV/panjang_r1_0] [get_bd_ports panjang_r1]
connect_bd_net [get_bd_pins EV/panjang_r2_0] [get_bd_ports panjang_r2]
connect_bd_net [get_bd_pins EV/panjang_r3_0] [get_bd_ports panjang_r3]
connect_bd_net [get_bd_pins EV/panjang_w0_0] [get_bd_ports panjang_w0]
connect_bd_net [get_bd_pins EV/panjang_w1_0] [get_bd_ports panjang_w1]
connect_bd_net [get_bd_pins EV/panjang_w2_0] [get_bd_ports panjang_w2]
connect_bd_net [get_bd_pins EV/panjang_w3_0] [get_bd_ports panjang_w3]
connect_bd_net [get_bd_pins EV/state] [get_bd_ports state] [get_bd_pins bram_input_interface_0/next_state]
connect_bd_net [get_bd_pins RAM_Block/q_next_0] [get_bd_ports dataout0] [get_bd_pins bram_output_interface_0/data0]
connect_bd_net [get_bd_pins RAM_Block/q_next_1] [get_bd_ports dataout1] [get_bd_pins bram_output_interface_0/data1]
connect_bd_net [get_bd_pins RAM_Block/q_next_2] [get_bd_ports dataout2] [get_bd_pins bram_output_interface_0/data2]
connect_bd_net [get_bd_pins RAM_Block/q_next_3] [get_bd_ports dataout3] [get_bd_pins bram_output_interface_0/data3]
connect_bd_net -net alpha_0_1 [get_bd_ports alpha] [get_bd_pins AGENT/alpha]
connect_bd_net -net batas_0_0_1 [get_bd_ports batas_0] [get_bd_pins EV/batas_0]
connect_bd_net -net batas_1_0_1 [get_bd_ports batas_1] [get_bd_pins EV/batas_1]
connect_bd_net -net batas_2_0_1 [get_bd_ports batas_2] [get_bd_pins EV/batas_2]
connect_bd_net -net batas_3_0_1 [get_bd_ports batas_3] [get_bd_pins EV/batas_3]
connect_bd_net -net batas_4_0_1 [get_bd_ports batas_4] [get_bd_pins EV/batas_4]
connect_bd_net -net batas_5_0_1 [get_bd_ports batas_5] [get_bd_pins EV/batas_5]
connect_bd_net -net batas_6_0_1 [get_bd_ports batas_6] [get_bd_pins EV/batas_6]
connect_bd_net [get_bd_pins bram_input_interface_0/en0_rd] [get_bd_pins RAM_Block/en0_rd] [get_bd_ports en0_rd]
connect_bd_net [get_bd_pins bram_input_interface_0/en0_wr] [get_bd_pins RAM_Block/en0_wr] [get_bd_ports en0_wr]
connect_bd_net [get_bd_pins bram_input_interface_0/en1_rd] [get_bd_pins RAM_Block/en1_rd] [get_bd_ports en1_rd]
connect_bd_net [get_bd_pins bram_input_interface_0/en1_wr] [get_bd_pins RAM_Block/en1_wr] [get_bd_ports en1_wr]
connect_bd_net [get_bd_pins bram_input_interface_0/en2_rd] [get_bd_pins RAM_Block/en2_rd] [get_bd_ports en2_rd]
connect_bd_net [get_bd_pins bram_input_interface_0/en2_wr] [get_bd_pins RAM_Block/en2_wr] [get_bd_ports en2_wr]
connect_bd_net [get_bd_pins bram_input_interface_0/en3_rd] [get_bd_pins RAM_Block/en3_rd] [get_bd_ports en3_rd]
connect_bd_net [get_bd_pins bram_input_interface_0/en3_wr] [get_bd_pins RAM_Block/en3_wr] [get_bd_ports en3_wr]
connect_bd_net -net bram_interface_0_rd_addr [get_bd_pins bram_input_interface_0/rd_addr] [get_bd_pins RAM_Block/rd_addr] [get_bd_ports rd_addr]
connect_bd_net -net bram_interface_0_wr_addr [get_bd_pins bram_input_interface_0/wr_addr] [get_bd_pins RAM_Block/wr_addr] [get_bd_ports wr_addr]
connect_bd_net -net clk_0_1 [get_bd_ports clk] \
  [get_bd_pins RAM_Block/clk_bram] [get_bd_pins AGENT/clk] [get_bd_pins EV/clk] [get_bd_pins bram_output_interface_0/clk] \
  [get_bd_pins bram_input_interface_0/clk] [get_bd_pins CU_0/clk]
connect_bd_net -net debit_out_0_1 [get_bd_ports debit_out] [get_bd_pins EV/debit_out]
connect_bd_net -net delta_t_0_1 [get_bd_ports delta_t] [get_bd_pins EV/delta_t]
connect_bd_net -net en_PG_1 [get_bd_pins CU_0/PG] [get_bd_pins AGENT/en_PG] [get_bd_ports PG]
connect_bd_net -net en_QA_1 [get_bd_pins CU_0/QA] [get_bd_pins AGENT/en_QA] [get_bd_ports QA]
connect_bd_net -net gamma_0_1 [get_bd_ports gamma] [get_bd_pins AGENT/gamma]
connect_bd_net -net max_episode_0_1 [get_bd_ports max_episode] [get_bd_pins CU_0/max_episode]
connect_bd_net -net max_step_0_1 [get_bd_ports max_step] [get_bd_pins CU_0/max_step]
connect_bd_net -net q_new_1 [get_bd_pins AGENT/new_qA] [get_bd_pins RAM_Block/q_new] [get_bd_ports new_qA]
connect_bd_net -net q_next_0_1 [get_bd_pins bram_output_interface_0/q0] [get_bd_pins AGENT/q_next_0] [get_bd_ports q_next_0]
connect_bd_net -net q_next_1_1 [get_bd_pins bram_output_interface_0/q1] [get_bd_pins AGENT/q_next_1] [get_bd_ports q_next_1]
connect_bd_net -net q_next_2_1 [get_bd_pins bram_output_interface_0/q2] [get_bd_pins AGENT/q_next_2] [get_bd_ports q_next_2]
connect_bd_net -net q_next_3_1 [get_bd_pins bram_output_interface_0/q3] [get_bd_pins AGENT/q_next_3] [get_bd_ports q_next_3]
connect_bd_net -net read_sig_0_1 [get_bd_ports read_sig] [get_bd_pins CU_0/read_sig]
connect_bd_net -net reward_0_0_1 [get_bd_ports reward_0] [get_bd_pins EV/reward_0]
connect_bd_net -net reward_1_0_1 [get_bd_ports reward_1] [get_bd_pins EV/reward_1]
connect_bd_net -net reward_2_0_1 [get_bd_ports reward_2] [get_bd_pins EV/reward_2]
connect_bd_net -net rst_0_1 [get_bd_ports rst] \
  [get_bd_pins RAM_Block/rst_bram] [get_bd_pins AGENT/rst] [get_bd_pins EV/rst] [get_bd_pins bram_output_interface_0/rst] \
  [get_bd_pins bram_input_interface_0/rst] [get_bd_pins CU_0/rst]
connect_bd_net -net seed1_0_1 [get_bd_ports seed_EG1] [get_bd_pins EV/seed_EG1]
connect_bd_net -net seed_0_1 [get_bd_ports seed] [get_bd_pins CU_0/seed]
connect_bd_net -net seed_0_2 [get_bd_ports seed_EG0] [get_bd_pins EV/seed_EG0]
connect_bd_net -net start_0_1 [get_bd_ports start] [get_bd_pins CU_0/start]
connect_bd_net -net state_sim_0_1 [get_bd_ports state_sim] [get_bd_pins EV/state_sim]
connect_bd_net -net wea_0_1 [get_bd_pins bram_input_interface_0/wen0] [get_bd_pins RAM_Block/wea_0] [get_bd_ports en0]
connect_bd_net -net wea_1_1 [get_bd_pins bram_input_interface_0/wen1] [get_bd_pins RAM_Block/wea_1] [get_bd_ports en1]
connect_bd_net -net wea_2_1 [get_bd_pins bram_input_interface_0/wen2] [get_bd_pins RAM_Block/wea_2] [get_bd_ports en2]
connect_bd_net -net wea_3_1 [get_bd_pins bram_input_interface_0/wen3] [get_bd_pins RAM_Block/wea_3] [get_bd_ports en3]

validate_bd_design
save_bd_design
